# EAGLE design pm2v (EAGLE 4.16)
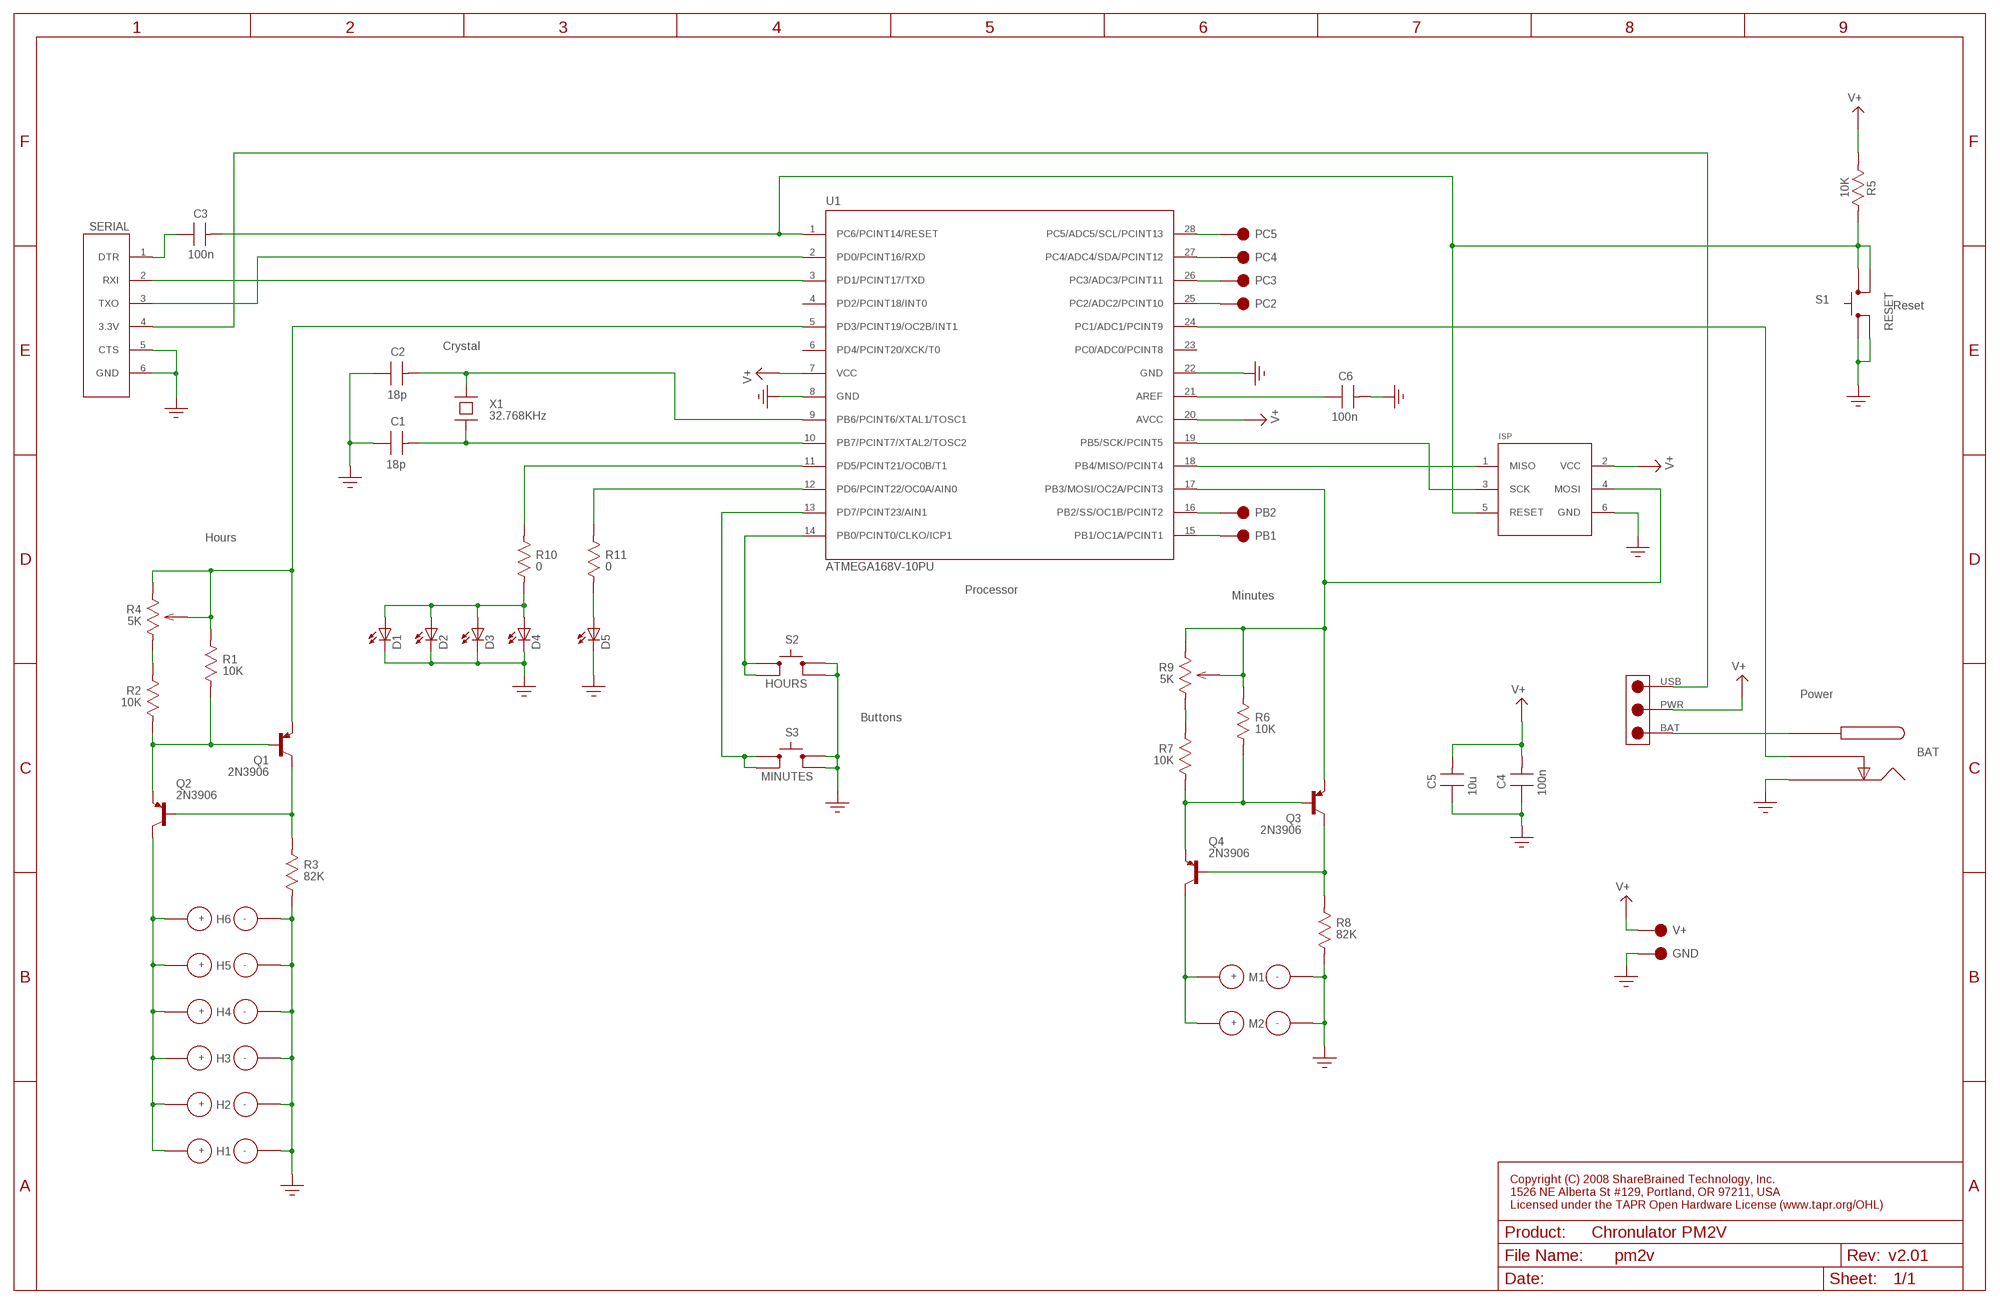
[diagram p0: schematic, sheet 1]

## Parts
BAT  CUI_PJ-007CUI_PJ-007-EZ  [CUI_PJ-007]
C1  18p  CEPCOS_B37987F-EZ  [EPCOS_B37987F]
C2  18p  CEPCOS_B37987F-EZ  [EPCOS_B37987F]
C3  100n  CEPCOS_B37987F-EZ  [EPCOS_B37987F]
C4  100n  CEPCOS_B37987F-EZ  [EPCOS_B37987F]
C5  10u  CEPCOS_B37987F-EZ  [EPCOS_B37987F]
C6  100n  CEPCOS_B37987F-EZ  [EPCOS_B37987F]
D1  LED  [LED5MM]
D2  LED  [LED5MM]
D3  LED  [LED5MM]
D4  LED  [LED5MM]
D5  LED  [LED5MM]
GND  GND  TP36MIL  [HOLE036]
H1  METER_FOOTPRINTGME_PM89  [GME_PM89]
H2  METER_FOOTPRINTGME_PM89  [GME_PM89]
H3  METER_FOOTPRINTGME_PM89  [GME_PM89]
H4  METER_FOOTPRINTGME_PM89  [GME_PM89]
H5  METER_FOOTPRINTGME_PM89  [GME_PM89]
H6  METER_FOOTPRINTGME_PM89  [GME_PM89]
ISP  ICSP  [ICSP]
LABEL1  Chronulator PM2V  VALUEVALUE  [VALUE]
M1  METER_FOOTPRINTGME_PM89  [GME_PM89]
M2  METER_FOOTPRINTGME_PM89  [GME_PM89]
PB1  PB1  TP36MIL  [HOLE036]
PB2  PB2  TP36MIL  [HOLE036]
PC2  PC2  TP36MIL  [HOLE036]
PC3  PC3  TP36MIL  [HOLE036]
PC4  PC4  TP36MIL  [HOLE036]
PC5  PC5  TP36MIL  [HOLE036]
PRODUCT_REV  v2.01  VALUEVALUE  [VALUE]
Q1  2N3906  2N3906TO92  [TO92]
Q2  2N3906  2N3906TO92  [TO92]
Q3  2N3906  2N3906TO92  [TO92]
Q4  2N3906  2N3906TO92  [TO92]
R1  10K  R0.25W  [0.25W]
R2  10K  R0.25W  [0.25W]
R3  82K  R0.25W  [0.25W]
R4  5K  RPANASONIC_EVUE[23]A  [PANASONIC_EVUE[23]A]
R5  10K  R0.25W  [0.25W]
R6  10K  R0.25W  [0.25W]
R7  10K  R0.25W  [0.25W]
R8  82K  R0.25W  [0.25W]
R9  5K  RPANASONIC_EVUE[23]A  [PANASONIC_EVUE[23]A]
R10  0  R0.25W  [0.25W]
R11  0  R0.25W  [0.25W]
S1  RESET  S2CK_PTS645S  [CK_PTS645S]
S2  HOURS  S2CK_PTS645S  [CK_PTS645S]
S3  MINUTES  S2CK_PTS645S  [CK_PTS645S]
SERIAL  FTDIBASIC  [FTDIBASIC]
U1  ATMEGA168V-10PU  [DIP-28-300MIL]
U$11  JUMPUSBBATPOWER  [JUMPUSBBATPOWER]
V+  V+  TP36MIL  [HOLE036]
X1  32.768KHz  X_EPSON_C-001R-EZ  [C-001R]

## Nets
BAT: BAT.1 U$11.BAT
GND: BAT.2 C1.1 C2.1 C4.1 C5.1 C6.2 D1.K(C) D2.K(C) D3.K(C) D4.K(C) D5.K(C) GND.P$1 H1.- H2.- H3.- H4.- H5.- H6.- ISP.6(GND) M1.- M2.- R3.P$1 R8.P$1 S1.3 S1.4 S2.1 S2.2 S3.1 S3.2 SERIAL.5(CTS) SERIAL.6(GND) U1.8(GND) U1.22(GND)
N$1: C2.2 U1.9(PB6/PCINT6/XTAL1/TOSC1) X1.2
N$2: C1.2 U1.10(PB7/PCINT7/XTAL2/TOSC2) X1.1
N$3: Q3.2(B) Q4.3(E) R6.P$1 R7.P$1
N$4: M1.+ M2.+ Q4.1(C)
N$5: S3.3 S3.4 U1.13(PD7/PCINT23/AIN1)
N$6: Q3.1(C) Q4.2(B) R8.P$2
N$7: ISP.4(MOSI) Q3.3(E) R6.P$2 R9.2 R9.3 U1.17(PB3/MOSI/OC2A/PCINT3)
N$8: ISP.1(MISO) U1.18(PB4/MISO/PCINT4)
N$9: PC3.P$1 U1.26(PC3/ADC3/PCINT11)
N$10: SERIAL.3(TXO) U1.2(PD0/PCINT16/RXD)
N$11: Q1.2(B) Q2.3(E) R1.P$1 R2.P$1
N$12: H1.+ H2.+ H3.+ H4.+ H5.+ H6.+ Q2.1(C)
N$13: SERIAL.2(RXI) U1.3(PD1/PCINT17/TXD)
N$14: ISP.3(SCK) U1.19(PB5/SCK/PCINT5)
N$15: C3.1 SERIAL.1(DTR)
N$16: C3.2 ISP.5(RESET) R5.P$1 S1.1 S1.2 U1.1(PC6/PCINT14/RESET)
N$17: Q1.3(E) R1.P$2 R4.2 R4.3 U1.5(PD3/PCINT19/OC2B/INT1)
N$18: PC5.P$1 U1.28(PC5/ADC5/SCL/PCINT13)
N$19: Q1.1(C) Q2.2(B) R3.P$2
N$20: PC4.P$1 U1.27(PC4/ADC4/SDA/PCINT12)
N$21: R2.P$2 R4.1
N$22: R7.P$2 R9.1
N$23: S2.3 S2.4 U1.14(PB0/PCINT0/CLKO/ICP1)
N$24: PC2.P$1 U1.25(PC2/ADC2/PCINT10)
N$25: PB2.P$1 U1.16(PB2/SS/OC1B/PCINT2)
N$26: PB1.P$1 U1.15(PB1/OC1A/PCINT1)
N$27: R10.P$2 U1.11(PD5/PCINT21/OC0B/T1)
N$28: R11.P$2 U1.12(PD6/PCINT22/OC0A/AIN0)
N$29: D1.A D2.A D3.A D4.A R10.P$1
N$30: D5.A R11.P$1
N$31: C6.1 U1.21(AREF)
N$33: BAT.3 U1.24(PC1/ADC1/PCINT9)
USB: SERIAL.4(3.3V) U$11.USB
V+: C4.2 C5.2 ISP.2(VCC) R5.P$2 U1.7(VCC) U1.20(AVCC) U$11.PWR V+.P$1
Unconnected: U1.4(PD2/PCINT18/INT0) U1.6(PD4/PCINT20/XCK/T0) U1.23(PC0/ADC0/PCINT8)

## Notes on the sheet
- Reset
- Crystal
- Hours
- Processor
- Minutes
- Power
- Buttons

## Library data of the parts
BAT = dc_jack:CUI_PJ-007
C1-C6 = capacitors_th:C
D1-D5 = led_th:LED
GND PB1 PB2 PC2-PC5 V+ = test:TP
H1-H6 M1 M2 = meters:METER_FOOTPRINT
ISP = atmel:ICSP
LABEL1 PRODUCT_REV = pcb:VALUE
Q1-Q4 = transistors_th:2N3906: PNP Transistor
R1-R3 R5-R8 R10 R11 = resistors_th:R
R4 R9 = potentiometers:R
S1-S3 = switches_th:S2
SERIAL = sparkfun:FTDIBASIC
U1 = atmel:ATMEGA168V-10
U$11 = jumper:JUMPUSBBATPOWER
X1 = crystals_th:X

## Net classes
0 default: width 0.305 mm, drill 0.305 mm, clearance 0.61 mm

## Board
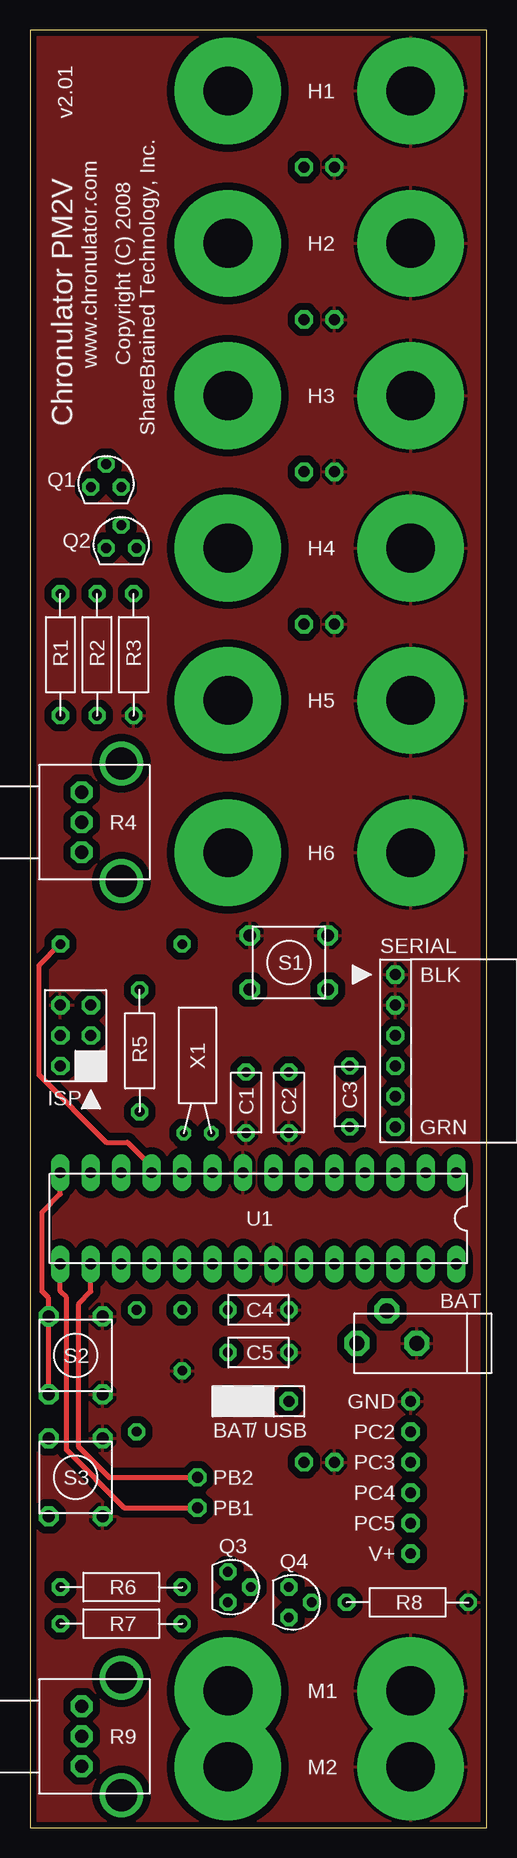
[diagram p1: board, top side]
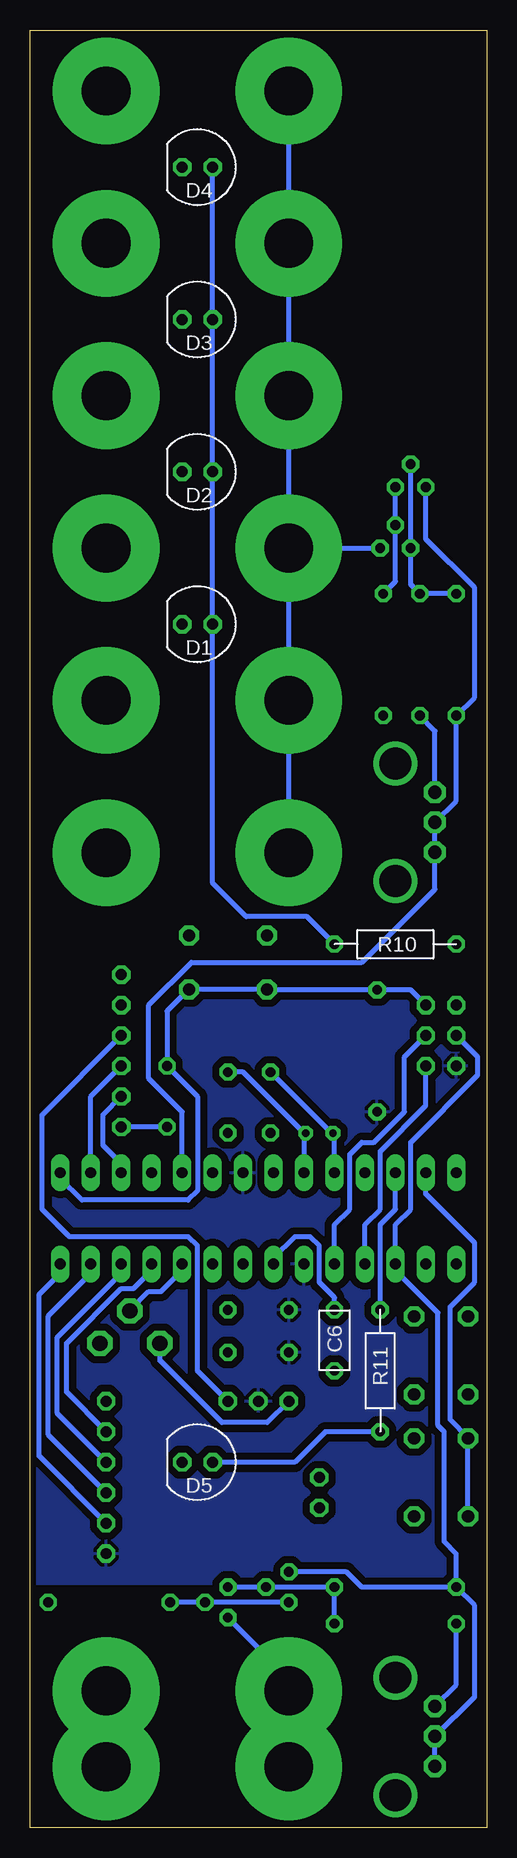
[diagram p2: board, bottom side, seen from below]

Size 38.1 x 149.86 mm. Coordinates in mm from the lower left corner, seen from the top.
Outline: 0,149.86 0,0 38.1,0 38.1,149.86 0,149.86
Copper layers (1*16): Top 0.035mm / dielectric 1.5748mm / Bottom 0.035mm
Design rules "pm2v": minimum track width 12mil, minimum drill 24mil, track to track 12mil, track to pad 12mil, pad to pad 12mil, via to via 12mil, smd to smd 12mil, copper to edge 20mil, drill to drill 20mil, minimum pad ring 12mil, minimum via ring 5mil, stop-mask expansion 3mil, vias tented up to drill 0mil, thermal gap 12mil

### Footprints (pad centres in the part's own frame; a part is rotated, then mirrored left to right if it is on the bottom)
CUI_PJ-007 = drill 1.27 octagon: 1 5.5,0; 2 0.5,0; 3 3,-2.7
EPCOS_B37987F = drill 0.813 octagon: 1 -2.54,0; 2 2.54,0
LED5MM = drill 0.914 octagon: A -1.27,0; K 1.27,0
HOLE036 = drill 0.914 octagon: P$1 0,0
GME_PM89 = drill 4.064 pad 8.89 round: + -7.62,0; - 7.62,0
ICSP = drill 0.914 octagon: 1 -1.27,2.54; 2 1.27,2.54; 3 -1.27,0; 4 1.27,0; 5 -1.27,-2.54; 6 1.27,-2.54
TO92 = drill 0.813 octagon: 1 1.27,0; 2 0,1.905; 3 -1.27,0
0.25W = drill 0.813 octagon: P$1 -5.08,0; P$2 5.08,0
PANASONIC_EVUE[23]A = drill 1.1 octagon: 1 -2.5,-3.3; 2 0,-3.3; 3 2.5,-3.3 | drill 2.64 round: X -4.9,0; X' 4.9,0
CK_PTS645S = drill 1.016 octagon: 1 3.25,2.25; 2 -3.25,2.25; 3 3.25,-2.25; 4 -3.25,-2.25
FTDIBASIC = drill 0.914 octagon: 1 0,6.35; 2 0,3.81; 3 0,1.27; 4 0,-1.27; 5 0,-3.81; 6 0,-6.35
DIP-28-300MIL = drill 0.914 long: 1 -3.81,16.51; 2 -3.81,13.97; 3 -3.81,11.43; 4 -3.81,8.89; 5 -3.81,6.35; 6 -3.81,3.81; 7 -3.81,1.27; 8 -3.81,-1.27; 9 -3.81,-3.81; 10 -3.81,-6.35; 11 -3.81,-8.89; 12 -3.81,-11.43; 13 -3.81,-13.97; 14 -3.81,-16.51; 15 3.81,-16.51; 16 3.81,-13.97; 17 3.81,-11.43; 18 3.81,-8.89; 19 3.81,-6.35; 20 3.81,-3.81; 21 3.81,-1.27; 22 3.81,1.27; 23 3.81,3.81; 24 3.81,6.35; 25 3.81,8.89; 26 3.81,11.43; 27 3.81,13.97; 28 3.81,16.51
JUMPUSBBATPOWER = drill 0.914 octagon: BAT -2.54,0; PWR 0,0; USB 2.54,0
C-001R = drill 0.61 octagon: 1 -1.143,-5.08; 2 1.143,-5.08

### Placement (x,y rotation side)
BAT  32.77,40.39 180 top
C1  18.03,60.45 90 top
C2  21.59,60.45 90 top
C3  26.67,60.96 90 top
C4  19.05,43.18 180 top
C5  19.05,39.62 180 top
C6  12.7,40.64 270 bottom
D1  24.13,100.33 180 bottom
D2  24.13,113.03 180 bottom
D3  24.13,125.73 180 bottom
D4  24.13,138.43 180 bottom
D5  24.13,30.48 180 bottom
GND  31.75,35.56 180 top
H1  24.13,144.78 0 top
H2  24.13,132.08 0 top
H3  24.13,119.38 0 top
H4  24.13,106.68 0 top
H5  24.13,93.98 0 top
H6  24.13,81.28 0 top
ISP  3.81,66.04 180 top
LABEL1  2.03,120.65 90 top
M1  24.13,11.43 0 top
M2  24.13,5.08 0 top
PB1  13.97,26.67 0 top
PB2  13.97,29.21 0 top
PC2  31.75,33.02 180 top
PC3  31.75,30.48 180 top
PC4  31.75,27.94 180 top
PC5  31.75,25.4 180 top
PRODUCT_REV  3.56,142.49 90 top
Q1  6.35,111.76 0 top
Q2  7.62,106.68 0 top
Q3  16.51,20.07 270 top
Q4  21.59,18.8 270 top
R1  2.54,97.79 270 top
R2  5.59,97.79 270 top
R3  8.64,97.79 90 top
R4  7.62,83.82 270 top
R5  9.14,64.77 270 top
R6  7.62,20.07 180 top
R7  7.62,17.02 180 top
R8  31.5,18.8 180 top
R9  7.62,7.62 270 top
R10  7.62,73.66 0 bottom
R11  8.89,38.1 90 bottom
S1  21.59,72.14 180 top
S2  3.81,39.37 270 top
S3  3.81,29.21 270 top
SERIAL  30.48,64.77 180 top
U1  19.05,50.8 270 top
U$11  19.05,35.56 0 top
V+  31.75,22.86 180 top
X1  13.97,62.99 0 top

### Tracks (layer width: path | path; a pad name or v marks a point on that pad's centre or on a via)
BAT
  Bottom 0.406: BAT.1 27.27,38.95 22.1,33.78 18.29,33.78 U$11.BAT
GND
  pour Top: 0,0 0,149.86 38.1,149.86 38.1,0
N$1
  Bottom 0.406: C2.2 20.32,62.99 15.24,57.91 | X1.2 15.24,57.91 | 15.24,57.91 U1.9
N$2
  Bottom 0.406: C1.2 12.95,57.91 X1.1 12.83,57.78 12.7,57.66 U1.10
N$3
  Bottom 0.406: Q4.3 Q3.2 R6.P$1 R7.P$1
N$4
  Bottom 0.406: Q4.1 16.51,12.45 M1.+ M2.+
N$5
  Bottom 0.406: U1.13 5.08,52.83 1.02,48.77 1.02,45.47 3.05,43.43 3.05,34.04 1.52,32.51 1.56,32.48 S3.4 1.56,32.29 1.52,32.26 1.56,32.22 S3.3
N$6
  Bottom 0.406: Q3.1 Q4.2 R8.P$2
N$7
  Bottom 0.406: Q3.3 11.68,21.34 10.41,20.07 R6.P$2 | R9.2 1.02,10.92 1.02,18.54 R6.P$2 | R9.2 | R9.3 R9.2 | R6.P$2 2.54,22.86 3.56,23.88 3.56,33.02 4.06,33.53 4.06,42.93 7.62,46.48 U1.17 7.62,50.29 6.35,51.56 6.35,57.15 0.76,62.74 0.76,64.26 ISP.4
N$8
  Bottom 0.406: U1.18 10.16,50.29 8.89,51.56 8.89,56.39 5.08,60.2 ISP.1
N$9
  Bottom 0.406: U1.26 30.48,46.23 35.81,40.89 35.81,34.54 PC3.P$1
N$10
  Bottom 0.406: U1.2 33.02,60.96 SERIAL.3
N$11
  Bottom 0.406: Q1.2 Q2.3 6.35,103.63 R2.P$1 R1.P$1
N$12
  Bottom 0.406: H4.+ Q2.1 | H6.+ H5.+ H4.+ | H4.+ H3.+ H2.+ H1.+
N$13
  Bottom 0.406: SERIAL.2 32,59.44 32,56.9 30.48,55.37 U1.3
N$14
  Bottom 0.406: U1.19 12.7,50.29 11.43,51.56 11.43,56.13 10.41,57.15 9.4,57.15 6.86,59.69 6.86,64.26 ISP.3
N$15
  Bottom 0.406: C3.1 SERIAL.1
N$16
  Bottom 0.406: U1.1 35.56,54.1 33.78,52.32 24.89,52.32 24.13,53.09 24.13,60.96 C3.2 26.67,68.07 24.86,69.89 S1.2 18.58,69.89 18.54,69.85 18.51,69.89 S1.1 18.32,69.89 18.29,69.85 R5.P$1 6.35,69.85 ISP.5
N$17
  Bottom 0.406: Q1.3 5.08,107.44 1.02,103.38 1.02,94.23 R1.P$2 2.54,85.6 R4.2 | R4.2 | 4.32,81.28 R4.3 | 4.32,81.28 R4.2 | U1.5 25.4,59.69 28.19,62.48 28.19,68.58 24.64,72.14 10.41,72.14 4.32,78.23 4.32,81.28
N$18
  Bottom 0.406: U1.28 35.56,46.23 37.34,44.45 37.34,30.99 PC5.P$1
N$19
  Bottom 0.406: Q1.1 Q2.2 7.62,103.89 R3.P$2
N$20
  Bottom 0.406: U1.27 33.02,46.23 36.58,42.67 36.58,32.77 PC4.P$1
N$21
  Bottom 0.406: R4.1 4.32,86.36 4.32,91.44 R2.P$2
N$22
  Bottom 0.406: R9.1 4.32,10.16 2.54,11.94 R7.P$2
N$23
  Top 0.406: S2.3 1.56,36.29 1.52,36.32 1.56,36.36 S2.4 1.56,44.16 1.02,44.7 1.02,51.31 2.54,52.83 U1.14
N$24
  Bottom 0.406: U1.25 27.94,46.48 29.46,44.96 30.48,44.96 35.05,40.39 35.05,36.32 PC2.P$1
N$25
  Top 0.406: U1.16 5.08,44.7 4.06,43.69 4.06,31.75 6.6,29.21 PB2.P$1
N$26
  Top 0.406: U1.15 2.54,44.7 3.05,44.2 3.05,31.5 7.87,26.67 PB1.P$1
N$27
  Top 0.406: U1.11 10.16,55.12 8.13,57.15 6.35,57.15 0.76,62.74 0.76,71.88 R10.P$2
N$28
  Bottom 0.406: U1.12 7.62,51.56 8.89,50.29 R11.P$2
N$29
  Bottom 0.406: D4.A D3.A D2.A D1.A 22.86,78.74 20.07,75.95 14.99,75.95 R10.P$1
N$30
  Bottom 0.406: D5.A 16,30.48 13.46,33.02 R11.P$1
N$31
  Bottom 0.406: U1.21 17.78,47.5 16,49.28 14.73,49.28 13.97,48.51 13.97,45.47 12.7,44.2 C6.1
N$33
  Bottom 0.406: U1.24 25.4,46.48 27.18,44.7 28.19,44.7 29.77,43.13 BAT.3
USB
  Bottom 0.406: SERIAL.4 37.08,59.44 37.08,51.56 34.8,49.28 24.89,49.28 24.13,48.51 24.13,38.1 U$11.USB
V+
  pour Bottom: 0,76.2 38.1,76.2 38.1,20.32 0,20.32

### Text on the board
tNames: www.chronulator.com | Copyright (C) 2008 | ShareBrained Technology, Inc.